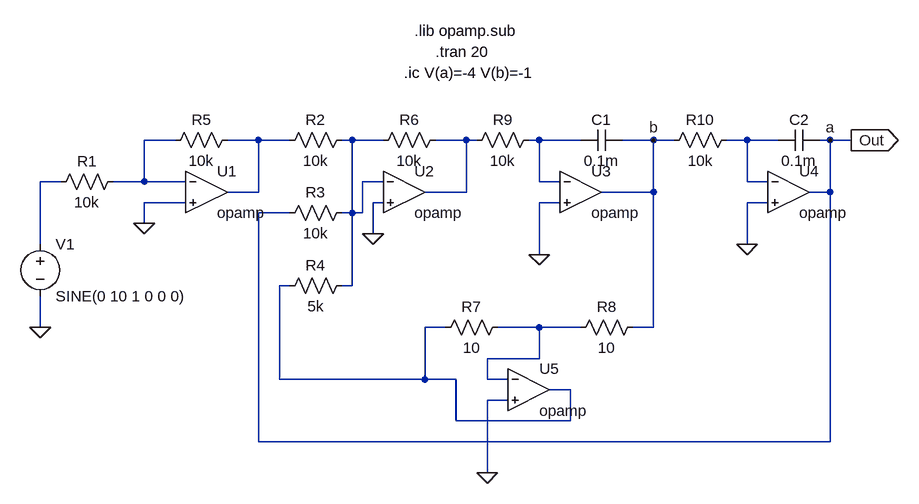
[diagram p0: schematic diffeqn.asc]
diffeqn.asc, the LTspice schematic file:
Version 4
SHEET 1 880 744
WIRE -272 160 -320 160
WIRE -144 160 -192 160
WIRE -96 160 -144 160
WIRE 0 160 -16 160
WIRE 48 160 0 160
WIRE 176 160 128 160
WIRE 192 160 176 160
WIRE 288 160 272 160
WIRE 352 160 288 160
WIRE 464 160 416 160
WIRE 496 160 464 160
WIRE 608 160 576 160
WIRE 656 160 608 160
WIRE 736 160 720 160
WIRE 768 160 736 160
WIRE -448 224 -480 224
WIRE -320 224 -320 160
WIRE -320 224 -368 224
WIRE -256 224 -320 224
WIRE 48 224 16 224
WIRE 288 224 288 160
WIRE 320 224 288 224
WIRE 608 224 608 160
WIRE 640 224 608 224
WIRE -144 240 -144 160
WIRE -144 240 -192 240
WIRE 176 240 176 160
WIRE 176 240 112 240
WIRE 464 240 464 160
WIRE 464 240 384 240
WIRE 736 240 736 160
WIRE 736 240 704 240
WIRE -256 256 -320 256
WIRE 48 256 32 256
WIRE 320 256 288 256
WIRE 640 256 608 256
WIRE -96 272 -144 272
WIRE 0 272 0 160
WIRE 0 272 -16 272
WIRE 16 272 16 224
WIRE 16 272 0 272
WIRE -320 288 -320 256
WIRE 32 304 32 256
WIRE -480 320 -480 224
WIRE 608 320 608 256
WIRE 288 336 288 256
WIRE -96 384 -112 384
WIRE 0 384 0 272
WIRE 0 384 -16 384
WIRE -480 448 -480 400
WIRE 144 448 112 448
WIRE 288 448 224 448
WIRE 352 448 288 448
WIRE 464 448 464 240
WIRE 464 448 432 448
WIRE 288 496 288 448
WIRE 288 496 208 496
WIRE -112 528 -112 384
WIRE 112 528 112 448
WIRE 112 528 -112 528
WIRE 160 528 112 528
WIRE 208 528 208 496
WIRE 240 528 208 528
WIRE 336 544 304 544
WIRE 240 560 208 560
WIRE 160 592 160 528
WIRE 336 592 336 544
WIRE 336 592 160 592
WIRE -144 624 -144 272
WIRE 736 624 736 240
WIRE 736 624 -144 624
WIRE 208 672 208 560
FLAG -320 288 0
FLAG 288 336 0
FLAG 608 320 0
FLAG -480 448 0
FLAG 32 304 0
FLAG 768 160 Out
IOPIN 768 160 Out
FLAG 736 160 a
FLAG 464 160 b
FLAG 208 672 0
SYMBOL Opamps\\opamp -224 176 R0
SYMATTR InstName U1
SYMBOL Opamps\\opamp 80 176 R0
SYMATTR InstName U2
SYMBOL Opamps\\opamp 352 176 R0
SYMATTR InstName U3
SYMBOL Opamps\\opamp 672 176 R0
SYMATTR InstName U4
SYMBOL res -464 240 R270
WINDOW 0 32 56 VTop 2
WINDOW 3 0 56 VBottom 2
SYMATTR InstName R1
SYMATTR Value 10k
SYMBOL res -112 176 R270
WINDOW 0 32 56 VTop 2
WINDOW 3 0 56 VBottom 2
SYMATTR InstName R2
SYMATTR Value 10k
SYMBOL res -112 288 R270
WINDOW 0 32 56 VTop 2
WINDOW 3 0 56 VBottom 2
SYMATTR InstName R3
SYMATTR Value 10k
SYMBOL res -112 400 R270
WINDOW 0 32 56 VTop 2
WINDOW 3 0 56 VBottom 2
SYMATTR InstName R4
SYMATTR Value 5k
SYMBOL Opamps\\opamp 272 480 R0
SYMATTR InstName U5
SYMBOL res -288 176 R270
WINDOW 0 32 56 VTop 2
WINDOW 3 0 56 VBottom 2
SYMATTR InstName R5
SYMATTR Value 10k
SYMBOL res 32 176 R270
WINDOW 0 32 56 VTop 2
WINDOW 3 0 56 VBottom 2
SYMATTR InstName R6
SYMATTR Value 10k
SYMBOL res 128 464 R270
WINDOW 0 32 56 VTop 2
WINDOW 3 0 56 VBottom 2
SYMATTR InstName R7
SYMATTR Value 10
SYMBOL res 336 464 R270
WINDOW 0 32 56 VTop 2
WINDOW 3 0 56 VBottom 2
SYMATTR InstName R8
SYMATTR Value 10
SYMBOL res 176 176 R270
WINDOW 0 32 56 VTop 2
WINDOW 3 0 56 VBottom 2
SYMATTR InstName R9
SYMATTR Value 10k
SYMBOL cap 352 176 R270
WINDOW 0 32 32 VTop 2
WINDOW 3 0 32 VBottom 2
SYMATTR InstName C1
SYMATTR Value 0.1m
SYMBOL res 480 176 R270
WINDOW 0 32 56 VTop 2
WINDOW 3 0 56 VBottom 2
SYMATTR InstName R10
SYMATTR Value 10k
SYMBOL cap 656 176 R270
WINDOW 0 32 32 VTop 2
WINDOW 3 0 32 VBottom 2
SYMATTR InstName C2
SYMATTR Value 0.1m
SYMBOL voltage -480 304 R0
WINDOW 123 24 124 Left 2
WINDOW 39 0 0 Left 2
SYMATTR InstName V1
SYMATTR Value SINE(0 10 1 0 0 0)
TEXT 96 -8 Left 2 !.lib opamp.sub
TEXT 128 24 Left 2 !.tran 20
TEXT 80 56 Left 2 !.ic V(a)=-4 V(b)=-1

The netlist it stands for:
* diffeqn.asc
XU1 N001 0 N002 opamp Aol=100K GBW=10Meg  ; pins invin noninvin out
XU2 N003 0 N004 opamp Aol=100K GBW=10Meg  ; pins invin noninvin out
XU3 N005 0 b opamp Aol=100K GBW=10Meg  ; pins invin noninvin out
XU4 N006 0 a opamp Aol=100K GBW=10Meg  ; pins invin noninvin out
R1 N007 N001 10k
R2 N002 N003 10k
R3 a N003 10k
R4 N008 N003 5k
XU5 N009 0 N008 opamp Aol=100K GBW=10Meg  ; pins invin noninvin out
R5 N001 N002 10k
R6 N003 N004 10k
R7 N008 N009 10
R8 N009 b 10
R9 N004 N005 10k
C1 N005 b 0.1m
R10 b N006 10k
C2 N006 a 0.1m
V1 N007 0 SINE(0 10 1 0 0 0)
.lib opamp.sub
.tran 20
.ic V(a)=-4 V(b)=-1
.backanno
.end